# Altium schematic sheet Peripherals.SchDoc
size A4
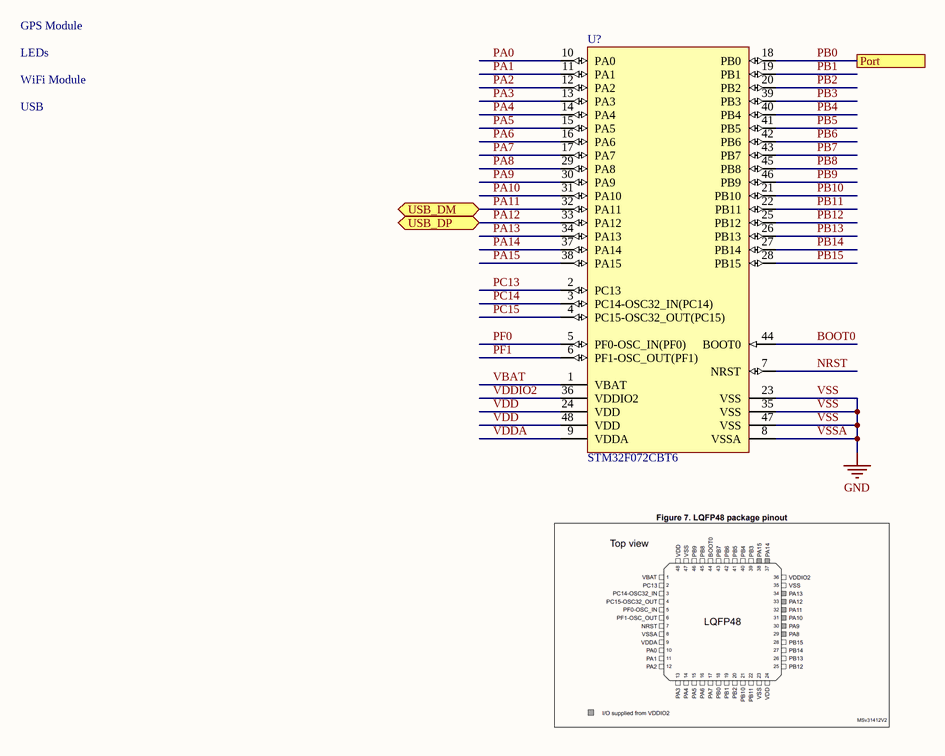
[diagram p0: Peripherals.SchDoc]

## Parts
U?  STM32F072CBT6  [STM-LQFP48_M]

## Ports
Port, USB_DM (bidir), USB_DP (bidir)

## Nets
VSS: U?.8(VSSA) U?.23(VSS) U?.35(VSS) U?.47(VSS)  [also labelled GND, VSSA]
BOOT0: U?.44(BOOT0)
NRST: U?.7(NRST)
PA0: U?.10(PA0)
PA1: U?.11(PA1)
PA2: U?.12(PA2)
PA3: U?.13(PA3)
PA4: U?.14(PA4)
PA5: U?.15(PA5)
PA6: U?.16(PA6)
PA7: U?.17(PA7)
PA8: U?.29(PA8)
PA9: U?.30(PA9)
PA10: U?.31(PA10)
PA11: U?.32(PA11) ; port USB_DM
PA12: U?.33(PA12) ; port USB_DP
PA13: U?.34(PA13)
PA14: U?.37(PA14)
PA15: U?.38(PA15)
PB0: U?.18(PB0) ; port Port
PB1: U?.19(PB1)
PB2: U?.20(PB2)
PB3: U?.39(PB3)
PB4: U?.40(PB4)
PB5: U?.41(PB5)
PB6: U?.42(PB6)
PB7: U?.43(PB7)
PB8: U?.45(PB8)
PB9: U?.46(PB9)
PB10: U?.21(PB10)
PB11: U?.22(PB11)
PB12: U?.25(PB12)
PB13: U?.26(PB13)
PB14: U?.27(PB14)
PB15: U?.28(PB15)
PC13: U?.2(PC13)
PC14: U?.3(PC14-OSC32_IN(PC14))
PC15: U?.4(PC15-OSC32_OUT(PC15))
PF0: U?.5(PF0-OSC_IN(PF0))
PF1: U?.6(PF1-OSC_OUT(PF1))
VBAT: U?.1(VBAT)
VDD: U?.24(VDD) U?.48(VDD)
VDDA: U?.9(VDDA)
VDDIO2: U?.36(VDDIO2)

## Notes on the sheet
- GPS Module
- LEDs
- WiFi Module
- USB

## Library data of the parts
U? = CMP-0304-00170-2: ARM Cortex-M0 32-bit MCU, 128 KB Flash, 16 KB Internal RAM, 37 I/Os, 48-Pin LQFP, -40 to 85 degC, Tray; Manufacturer: STMicroelectronics; I/Os (High Current): 37; Operating Frequency(F) (Processor speed) (MHz): 48; FLASH Size (Prog) (kB): 128; Internal RAM Size (kB): 16; D/A Converter: 1; Supply Voltage(Vcc) min (V): 2; ComponentLink2URL: http://www.st.com/st-web-ui/static/active/en/resource/technical/document/datasheet/DM00090510.pdf; Packing: Tray; DatasheetVersion: Rev. 5; ComponentLink2Description: Datasheet; Package Reference: LQFP48; Core: ARM Cortex-M0; PartNumber: STM32F072CBT6; ComponentLink1Description: Manufacturer URL; Package Description: 48-Pin Low Profile Quad Flat Package, Body 7 x 7 mm, Pitch 0.5 mm; ComponentLink1URL: http://www.st.com/; Mounting Technology: Surface Mount